# Altium project Ethernet2MIL Adapter.PrjPcb (part 3 of 3)

## Sheet USB_DataOnly.SchDoc
size A2; SheetNumber: 8; SheetTotal: 14
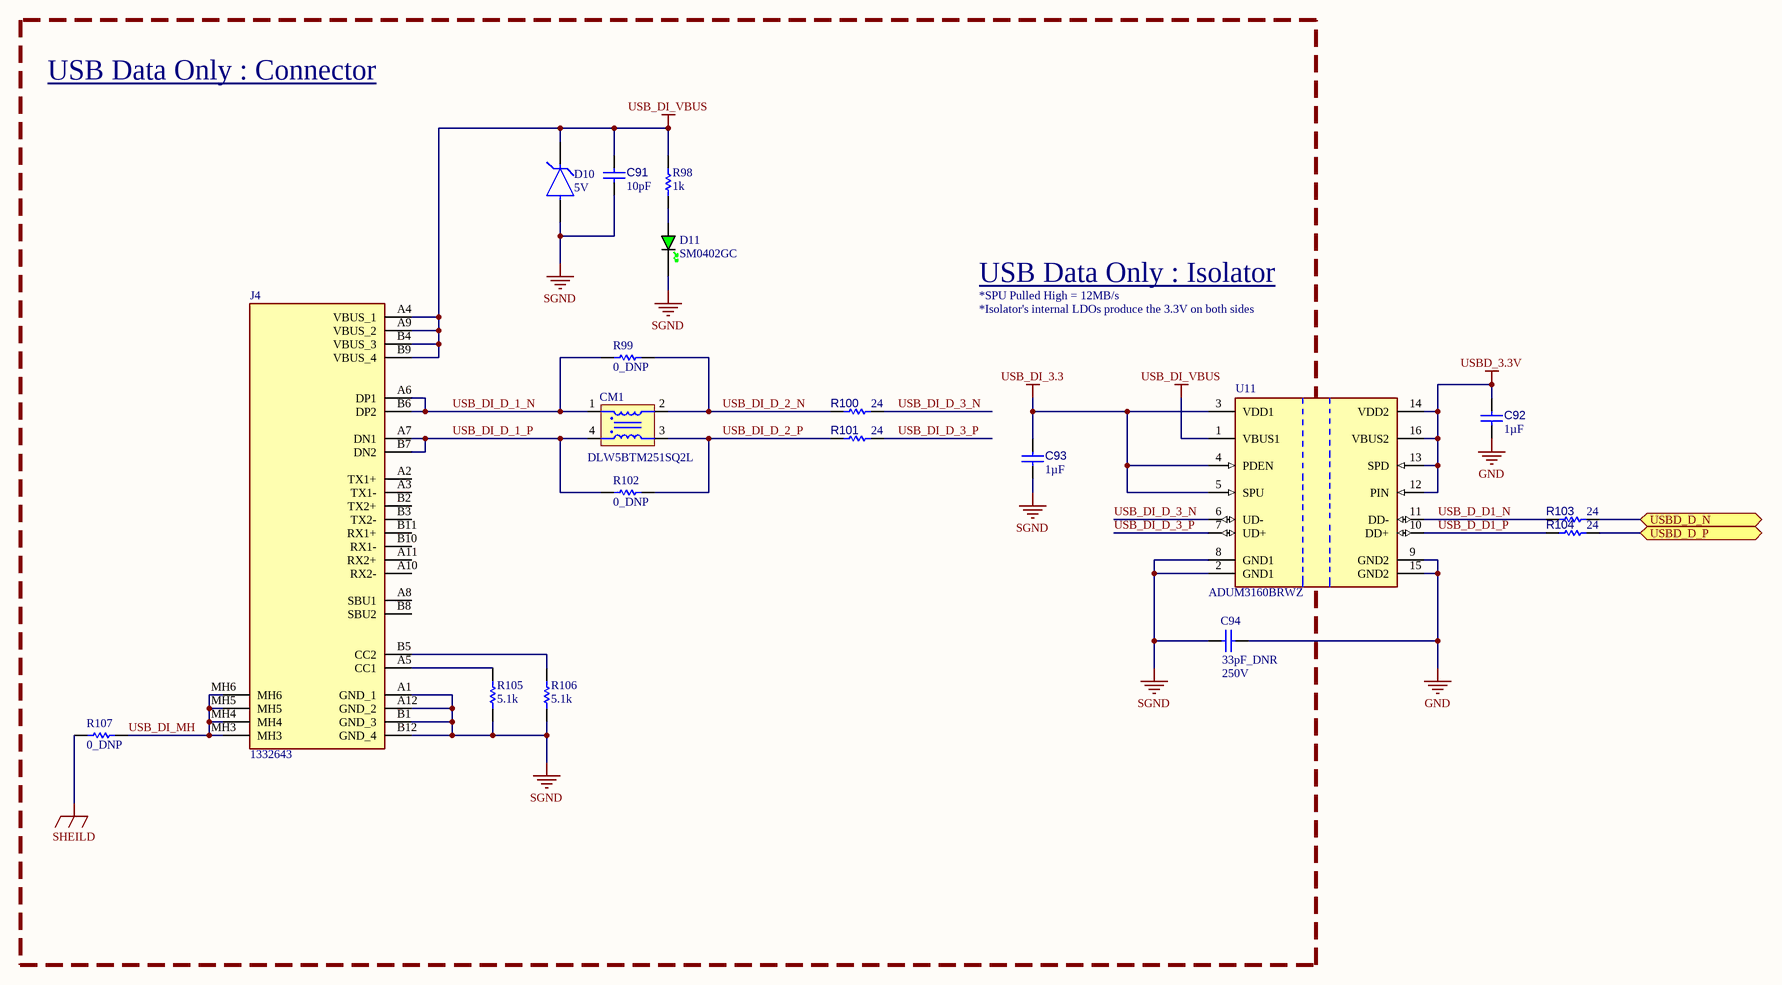
[diagram p11: USB_DataOnly.SchDoc]

### Parts
C91  value 10pF  [CAPC1005X55X25ML05T05]  (hidden comment: Capacitor 10 pF +/- 5% 50 V 0402)
C92  value 1µF  [CAPC2013X135X45NL10T25]  (hidden comment: Capacitor 1 uF +/- 10% 50 V 0805)
C93  value 1µF  [CAPC2013X135X45NL10T25]  (hidden comment: Capacitor 1 uF +/- 10% 50 V 0805)
C94  Capacitance: 33pF_DNR  Voltage Rating: 250V  [WCAP-CSSA_1808_L4.5W2H1.4]  (hidden comment: 8853520100071)
CM1  DLW5BTM251SQ2L  [CMC-2020]
D10  Reverse Standoff Voltage: 5V  [FP-SMA-MFG]  (hidden comment: SMAJ5.0A-13-F)
D11  SM0402GC  [FP-SM0402GC-MFG]
J4  1332643  [1332643]
R98  value 1k  [RESC0402(1005)_L]  (hidden comment: Resistor 1K +/-5 % 0402 63 mW)
R99  value 0_DNP  [RESC1005X40X25ML05T05]  (hidden comment: Resistor 0R +/- 5% 0402 63 mW)
R100  value 24  [FP-CR0402-IPC_C]  (hidden comment: CR0402-FX-24R0GLF)
R101  value 24  [FP-CR0402-IPC_C]  (hidden comment: CR0402-FX-24R0GLF)
R102  value 0_DNP  [RESC1005X40X25ML05T05]  (hidden comment: Resistor 0R +/- 5% 0402 63 mW)
R103  value 24  [FP-CR0402-IPC_C]  (hidden comment: CR0402-FX-24R0GLF)
R104  value 24  [FP-CR0402-IPC_C]  (hidden comment: CR0402-FX-24R0GLF)
R105  value 5.1k  [FP-RN73R1E-MFG]  (hidden comment: RN73R1ETTP5101F25)
R106  value 5.1k  [FP-RN73R1E-MFG]  (hidden comment: RN73R1ETTP5101F25)
R107  value 0_DNP  [RESC1005X40X25ML05T05]  (hidden comment: Resistor 0R +/- 5% 0402 63 mW)
U11  ADUM3160BRWZ  [FP-RW-16-IPC_C]

### Ports
USBD_D_N (bidir), USBD_D_P (bidir)

### Nets
GND: C92.1 C94.2 U11.9(GND2) U11.15(GND2)
SGND: C91.1 C93.1 C94.1 D10.2(A) D11.K J4.A1(GND_1) J4.A12(GND_2) J4.B1(GND_3) J4.B12(GND_4) R105.1 R106.1 U11.2(GND1) U11.8(GND1)
SHEILD: R107.1
USB_DI_3.3: C93.2 U11.3(VDD1) U11.4(PDEN) U11.5(SPU)
USB_DI_VBUS: C91.2 D10.1(C) J4.A4(VBUS_1) J4.A9(VBUS_2) J4.B4(VBUS_3) J4.B9(VBUS_4) R98.2 U11.1(VBUS1)
USBD_3.3V: C92.2 U11.12(PIN) U11.13(SPD) U11.14(VDD2) U11.16(VBUS2)
USB_D_D1_N: R103.1 U11.11(DD-)
USB_D_D1_P: R104.1 U11.10(DD+)
USB_DI_D_1_N: CM1.1 J4.A6(DP1) J4.B6(DP2) R99.1
USB_DI_D_1_P: CM1.4 J4.A7(DN1) J4.B7(DN2) R102.1
USB_DI_D_2_N: CM1.2 R99.2 R100.1
USB_DI_D_2_P: CM1.3 R101.1 R102.2
USB_DI_D_3_N: R100.2 U11.6(UD-)
USB_DI_D_3_P: R101.2 U11.7(UD+)
USB_DI_MH: J4.MH3 J4.MH4 J4.MH5 J4.MH6 R107.2
NetD11_A: D11.A R98.1
NetJ4_A5: J4.A5(CC1) R105.2
NetJ4_B5: J4.B5(CC2) R106.2
NetR103_2: R103.2 ; port USBD_D_N
NetR104_2: R104.2 ; port USBD_D_P

Not connected (* = marked no-connect by the designer): J4 A2(TX1+) A3(TX1-) A8(SBU1) A10(RX2-) A11(RX2+) B2(TX2+) B3(TX2-) B8(SBU2) B10(RX1-) B11(RX1+)

### Notes on the sheet
- USB Data Only : Connector
- *SPU Pulled High = 12MB/s
- USB Data Only : Isolator
- *Isolator's internal LDOs produce the 3.3V on both sides

### Library data of the parts
C91 = CMP-001-00013-7: Chip Capacitor, 10 pF, +/- 5%, 50 V, 0402 (1005 Metric); Voltage Rating: 50V; Capacitor Type: Ceramic; Case/Package: 0402; Pins: 2; Tolerance: 5%; Max Operating Temperature: 125°C; RoHS Compliant: True; Mounting Technology: SM; Min Operating Temperature: -55°C
C92 C93 = CMP-001-00007-7: Chip Capacitor, 1 uF, +/- 10%, 50 V, 0805 (2012 Metric); Voltage Rating: 50V; Capacitor Type: Ceramic; Tolerance: 10%; Case/Package: 0805; RoHS Compliant: True; Min Operating Temperature: -55°C; Max Operating Temperature: 125°C; Mounting Technology: SM; Pins: 2
C94 = CMP-03913-107854629-1: 8853520100071 Suppression Cap, 33Pf, Class X1/Y2 Rohs Compliant: Yes; Insulation Resistance: 100GΩ; Max Operating Temperature: 125°C; Width: 2mm; NexarPartId: 107854629; RoHS: Compliant; Min Operating Temperature: -55°C; Height: 1.4mm; Length: 4.5mm
CM1 = CMP-049-000083-1: Common Mode Choke 5A 250R 20mR; Manufacturer: Murata; Distributor Link: https://www.mouser.de/ProductDetail/Murata-Electronics/DLW5BTM251SQ2L?qs=6RPrPjhwTH9TmsO%252BRNiuwA%3D%3D; Design Item ID: DLW5BTM251SQ2L; Manufacturer Part Number: DLW5BTM251SQ2L; LCSC: C576407; Source: Schematic-Lib-PhilsLab.SchLib
D10 = CMP-004-00031-1: TVS DIODE 5V 9.2V SMA; Manufacturer: Diodes Inc.; Peak Pulse Current: 43.5A; Direction: Unidirectional; Standoff Height: 0.05mm; Max Junction Temp: +150°C; Breakdown Voltage: 6.4V; Peak Pulse Power: 400W; Number Of Channels: 1; Pins: 2; Device Class L3: unset; Device Class L1: Circuit Protection; Category: Diode; Manufacturer Part Number: SMAJ5.0A-13-F; Footprint Url: https://www.diodes.com/assets/Package-Files/SMA.pdf; Case/Package: SMA; Source: CodyStates.SchLib; Component Type: Standard; Temperature: -55°C to +150°C; Temperature Range High: 150°C; Automotive: No; Mouser Description: TVS DIODE 5V 9.2V SMA; Octopart: https://octopart.com/smaj5.0a-13-f-diodes+inc.-350158; Lead Free: Yes; Device Class L2: TVS Diodes; RoHS: TRUE; Clamping Voltage: 9.2V; Height: 2.4mm; Temperature Range Low: -55°C; Design Item ID: SMAJ5.0A-13-F; Digikey Description: TVS DIODE 5V 9.2V SMA
D11 = CMP-007-00038-1: LED Uni-Color Green 575nm 2-PinChip 0402(1006Metric) T/R; Forward Voltage: 2.6V; Forward Current: 30mA; Min Operating Temperature: -30°C; Case/Package: 0402; Max Operating Temperature: 80°C; Mounting Technology: Surface Mount
J4 = CMP-002-00162-2: USB-C connector. Horizontal layout. 5A amp rated.; Manufacturer_Name: Phoenix Contact; Mouser Part Number: 651-1332643; Manufacturer_Part_Number: 1332643; Height: 3.31mm; Arrow Part Number: 1332643; Mouser Price/Stock: https://www.mouser.co.uk/ProductDetail/Phoenix-Contact/1332643?qs=Znm5pLBrcAJhPoOCsTWMGg%3D%3D; Design Item ID: 1332643; Datasheet Link: http://www.phoenixcontact.com/de/produkte/1332643; Arrow Price/Stock: https://www.arrow.com/en/products/1332643/phoenix-contact?utm_currency=USD&region=nac; Source: SamacSys.SchLib
R98 = CMP-009-00157-4: Chip Resistor, 1 kOhms, +/-5 %, 63 mW, -55 to 155 degC, 0402; Tolerance: 5%; Power: 63mW; Pins: 2; Max Operating Temperature: 155°C; Min Operating Temperature: -55°C; Case/Package: 0402
R99 R102 R107 = CMP-009-00003-6: Chip Resistor, 0 Ohm, +/- 5%, 63 mW, -55 to 155 degC, 0402 (1005 Metric); Power: 63mW; Voltage Rating: 50V; Pins: 2; Max Operating Temperature: 155°C; Min Operating Temperature: -55°C; Tolerance: 5%; Mounting Technology: SM; Case/Package: 0402; RoHS Compliant: True
R100 R101 R103 R104 = CMP-009-00212-1: Res Thick Film 0402 24 Ohm 1% 0.063W(1/16W) ±100ppm/C Pad SMD T/R; Voltage Rating: 50V; Min Operating Temperature: -55°C; Max Operating Temperature: 155°C; Case/Package: 0402; Tolerance: 1%; Mounting Technology: Surface Mount
R105 R106 = CMP-00000-1: Fixed Resistor, Thin Film, 0.1W, 5100ohm, 50V, 1% +/-Tol, 25ppm/Cel, Surface Mount, 0402; Power Dissipation: 63mW; Temperature Coefficient: 25ppm/°C; Composition: Thin Film; Mounting Technology: Surface Mount; Case/Package: 0402; Min Operating Temperature: -55°C; Voltage Rating: 50V; Power Rating: 63mW; Max Operating Temperature: 155°C; REACH SVHC: Yes; Ambient Temperature Range High: 85°C; Tolerance: 1%; Lifecycle Status: Production; Working Voltage: 50V; Height: 350µm; Number of Terminals: 2; RoHS: Compliant; Width: 500µm
U11 = CMP-2000-05766-2: DGT ISOL 2500VRMS 2CH USB 16SOIC; Rise Time: 1ms; Max Input Current: 8mA; Isolation Voltage: 2.5kV; Number of Channels: 2; Isolated Power: No; Nominal Supply Current: 6mA; Min Supply Voltage: 4V; Channel Type: Bidirectional; Propagation Delay: 70ns; Max Supply Voltage: 5.5V; Data Rate: 12Mbps; Case/Package: SOIC; Width: 7.6mm; Lead Free: Contains Lead; Number of Pins: 16; Depth: 2.35mm; Length: 10.5mm; Mount: Surface Mount; Contact Plating: Tin; Package Quantity: 47; Packaging: Rail/Tube; Number of Input Lines: 2; Min Operating Temperature: -40°C; Max Operating Temperature: 105°C; REACH SVHC: No SVHC; Turn-On Delay Time: 70ns

## Sheet Artix7_ProgramAndConfig.SchDoc
size A2; SheetNumber: 10; SheetTotal: 14
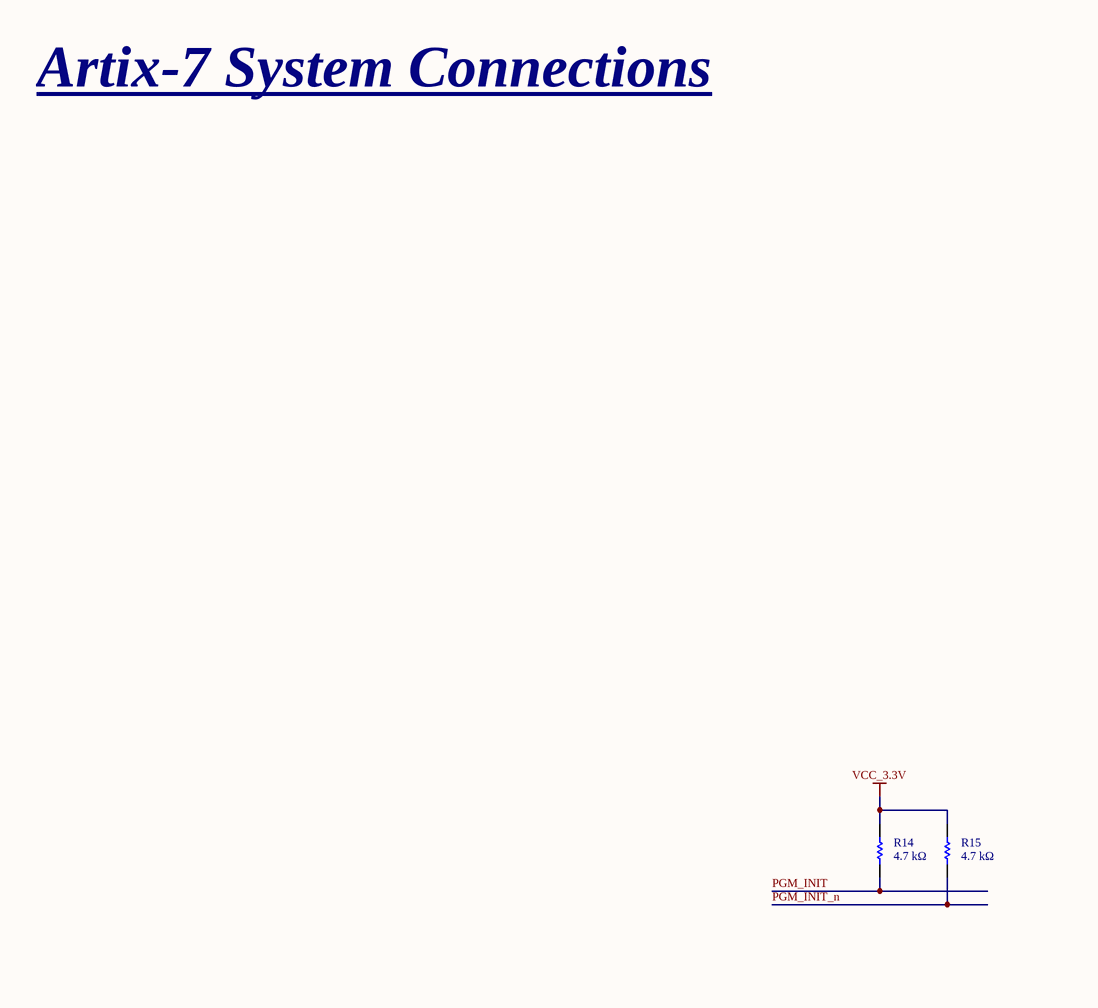
[diagram p12: Artix7_ProgramAndConfig.SchDoc, left]
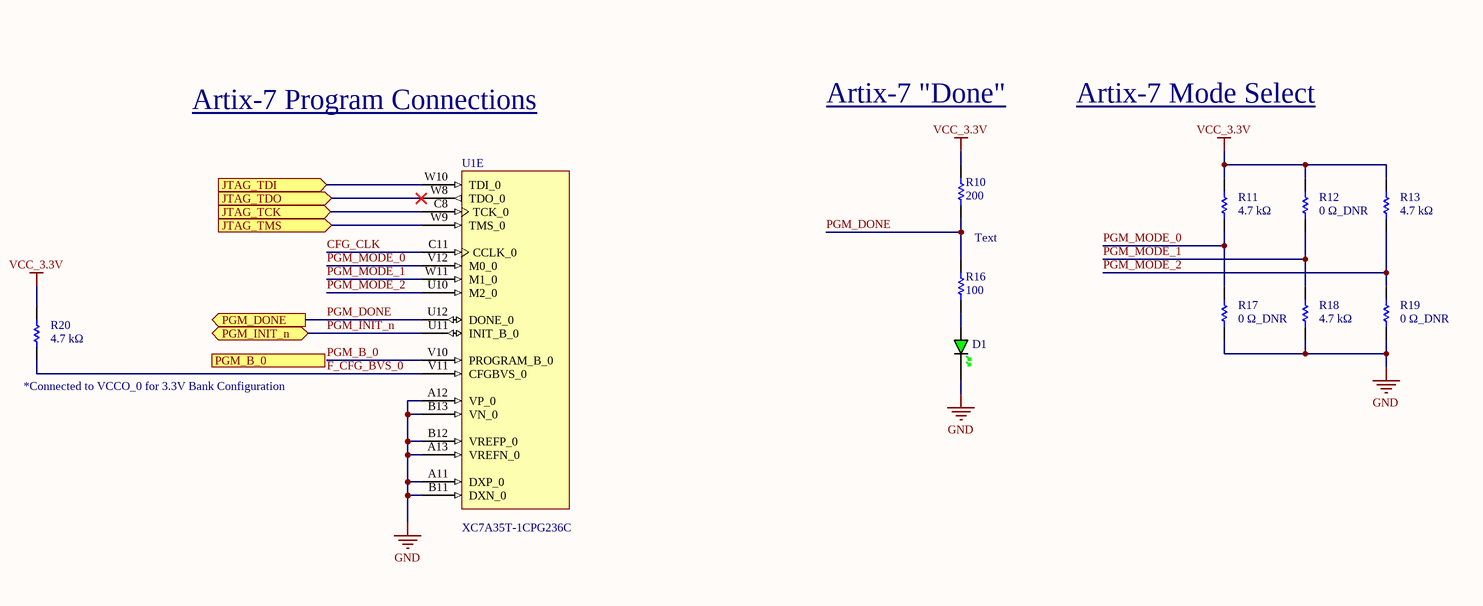
[diagram p13: Artix7_ProgramAndConfig.SchDoc, right]

### Parts
D1  LED_0402_GREEN  [LED_0402_GREEN]  (value not drawn)
R10  value 200  [RESC0402(1005)_L]  (hidden comment: Resistor 200R +/-5 % 0402 63 mW)
R11  Resistance: 4.7 kΩ  [RESC1608X55X30LL15T15]  (hidden comment: ERJ-3EKF4701V)
R12  Resistance: 0 Ω_DNR  [RESC1608X55X30LL15T15]  (hidden comment: ERJ-3EKF4701V)  (no BOM)
R13  Resistance: 4.7 kΩ  [RESC1608X55X30LL15T15]  (hidden comment: ERJ-3EKF4701V)
R14  Resistance: 4.7 kΩ  [RESC1608X55X30LL15T15]  (hidden comment: ERJ-3EKF4701V)
R15  Resistance: 4.7 kΩ  [RESC1608X55X30LL15T15]  (hidden comment: ERJ-3EKF4701V)
R16  value 100  [RESC0402(1005)_L]  (hidden comment: Resistor 100R +/-1 % 0402 63 mW)
R17  Resistance: 0 Ω_DNR  [RESC1608X55X30LL15T15]  (hidden comment: ERJ-3EKF4701V)  (no BOM)
R18  Resistance: 4.7 kΩ  [RESC1608X55X30LL15T15]  (hidden comment: ERJ-3EKF4701V)
R19  Resistance: 0 Ω_DNR  [RESC1608X55X30LL15T15]  (hidden comment: ERJ-3EKF4701V)  (no BOM)
R20  Resistance: 4.7 kΩ  [RESC1608X55X30LL15T15]  (hidden comment: ERJ-3EKF4701V)
U1  XC7A35T-1CPG236C  [CPG236]  (part E of 10)

### Ports
JTAG_TCK (in), JTAG_TDI (in), JTAG_TDO (in), JTAG_TMS (in), PGM_B_0 (in), PGM_DONE (out), PGM_INIT_n (bidir)

### Nets
GND: D1.K R17.1 R18.1 R19.1 U1.A11(DXP_0) U1.A12(VP_0) U1.A13(VREFN_0) U1.B11(DXN_0) U1.B12(VREFP_0) U1.B13(VN_0)
VCC_3.3V: R10.2 R11.2 R12.2 R13.2 R14.2 R15.2 R20.2
CFG_CLK: U1.C11(CCLK_0)
F_CFG_BVS_0: R20.1 U1.V11(CFGBVS_0)
PGM_B_0: U1.V10(PROGRAM_B_0)
PGM_DONE: R10.1 R16.2 U1.U12(DONE_0) ; port PGM_DONE
PGM_INIT: R14.1
PGM_INIT_n: R15.1 U1.U11(INIT_B_0) ; port PGM_INIT_n
PGM_MODE_0: R11.1 R17.2 U1.V12(M0_0)
PGM_MODE_1: R12.1 R18.2 U1.W11(M1_0)
PGM_MODE_2: R13.1 R19.2 U1.U10(M2_0)
NetD1_A: D1.A R16.1
NetU1_C8: U1.C8(TCK_0) ; port JTAG_TCK
NetU1_W8: U1.W8(TDO_0) ; port JTAG_TDO
NetU1_W9: U1.W9(TMS_0) ; port JTAG_TMS
NetU1_W10: U1.W10(TDI_0) ; port JTAG_TDI

### Notes on the sheet
- Artix-7 System Connections
- Artix-7 "Done"
- Artix-7 Mode Select
- Artix-7 Program Connections
- Text
- (near R20) *Connected to VCCO_0 for 3.3V Bank Configuration

### Library data of the parts
D1 = CMP-004-00056-2: LED 0402 GREEN SMD; Design Item ID: LED_0402_GREEN
R10 = CMP-009-00161-4: Chip Resistor, 200 Ohms, +/-5 %, 63 mW, -55 to 155 degC, 0402; Power: 63mW; Tolerance: 5%; Case/Package: 0402; Max Operating Temperature: 155°C; Pins: 2; Min Operating Temperature: -55°C
R11-R15 R17-R20 = CMP-009-00185-1: Fixed Resistor, Metal Glaze/thick Film, 0.1W, 4700ohm, 75V, 1% +/-Tol, 100ppm/Cel, Surface Mount, 0603; Power: 100mW; Value: 4.7k; Max Operating Temperature: 155°C; Tolerance: 1%; Mounting Technology: Surface Mount; RoHS Compliant: Yes; Min Operating Temperature: -55°C; Case/Package: 0603; Pins: 2
R16 = CMP-009-00167-4: Chip Resistor, 100 Ohms, +/-1 %, 63 mW, -55 to 155 degC, 0402; Power: 63mW; Tolerance: 1%; Min Operating Temperature: -55°C; Max Operating Temperature: 155°C; Case/Package: 0402; Pins: 2
U1 = CMP-0383-00006-1: Artix-7 FPGA, 106 User I/Os, 2 GTP, 238-Ball BGA, Speed Grade 1, Commercial Grade, Pb-Free; Manufacturer: Xilinx; CMTs: 5; Total Block RAM: 1800 Kb; Logic Cells: 33280; Speed Grades: 1; GTP: 2; Available User I/O: 106; ComponentLink1URL: http://www.xilinx.com/; Maximum Distributed RAM: 400 Kb; PackageVersion: Rev. 1.11; PartNumber: XC7A35T-1CPG236C; ComponentLink2URL: http://www.xilinx.com/support/documentation/data_sheets/ds180_7Series_Overview.pdf; DatasheetVersion: Rev. 1.15; ComponentLink1Description: Manufacturer URL; ComponentLink3Description: Pinout; ComponentLink4Description: Package Specification; Mounting Technology: Surface Mount; PackageReference: CPG-236; Operating Temperature Range: Commercial; PackageDescription: 238-Ball Wire-Bond Chip-Scale BGA, Body 10 x10 mm, Pitch 0.5 mm; ComponentLink3URL: http://www.xilinx.com/support/documentation/user_guides/ug475_7Series_Pkg_Pinout.pdf; ComponentLink4URL: http://www.xilinx.com/support/documentation/user_guides/ug475_7Series_Pkg_Pinout.pdf; ComponentLink2Description: Datasheet

## Nets that join several sheets
+5: Artix-7 MIL-STD-1553 Connections/1A (C62.1.2 U5.1.12), Artix-7 MIL-STD-1553 Connections/1B (C62.2.2 U5.2.12), USB_FTDI (C103.2 U13.8)
GND: Artix7_IO_General (C63.2), Artix-7 MIL-STD-1553 Connections/1A (17 pins), Artix-7 MIL-STD-1553 Connections/1B (17 pins), Artix7_Power_1 (13 pins), Artix7_Power_Grounds (67 pins), Artix7_SRAM (12 pins), Ethernet_PHY (34 pins), Power_SwitchRegulators (17 pins), USB_FTDI (27 pins), USB_PowerOnly (21 pins), USB_DataOnly (C92.1 C94.2 U11.9 U11.15), Artix7_ProgramAndConfig (10 pins)
MIL_1553_3.3V: Artix-7 MIL-STD-1553 Connections/1A (C61.1.2 R44.1.2 U4.1.5 U5.1.5), Artix-7 MIL-STD-1553 Connections/1B (C61.2.2 R44.2.2 U4.2.5 U5.2.5)
SHEILD: USB_PowerOnly (J1.MH3 J1.MH4 J1.MH5 J1.MH6), USB_DataOnly (R107.1)
VCC_1.8V: Artix7_Power_1 (8 pins), Power_SwitchRegulators (5 pins)
VCC_1V: Artix7_Power_1 (15 pins), Power_SwitchRegulators (5 pins)
VCC_3.3V: Artix7_IO_General (C63.1 R50.1), Artix7_SRAM (16 pins), Power_SwitchRegulators (5 pins), USB_FTDI (D12.1 J5.6), Artix7_ProgramAndConfig (7 pins)
VCC_5V: Artix-7 MIL-STD-1553 Connections/1A (8 pins), Artix-7 MIL-STD-1553 Connections/1B (8 pins), Power_SwitchRegulators (8 pins), USB_PowerOnly (C50.2 Q1.5 Q1.6 U3.11)
RX_OUT: Artix7_IO_General (R53.1), Artix-7 MIL-STD-1553 Connections/1A (U5.1.1)
RX_OUT: Artix7_IO_General (R56.1), Artix-7 MIL-STD-1553 Connections/1B (U5.2.1)
TX_OUT_N: Artix7_IO_General (R52.2), Artix-7 MIL-STD-1553 Connections/1A (IC1.1.4)
TX_OUT_N: Artix7_IO_General (R55.2), Artix-7 MIL-STD-1553 Connections/1B (IC1.2.4)
TX_OUT_P: Artix7_IO_General (R51.2), Artix-7 MIL-STD-1553 Connections/1A (IC1.1.2)
TX_OUT_P: Artix7_IO_General (R54.2), Artix-7 MIL-STD-1553 Connections/1B (IC1.2.2)

## Assembly variants
Continous GND Plane Varient: all parts fitted
Default_MC_spi2_FPGA: all parts fitted
Direct Bank34 VRef: all parts fitted